# Altium schematic sheet SIM900A.SchDoc
size A4
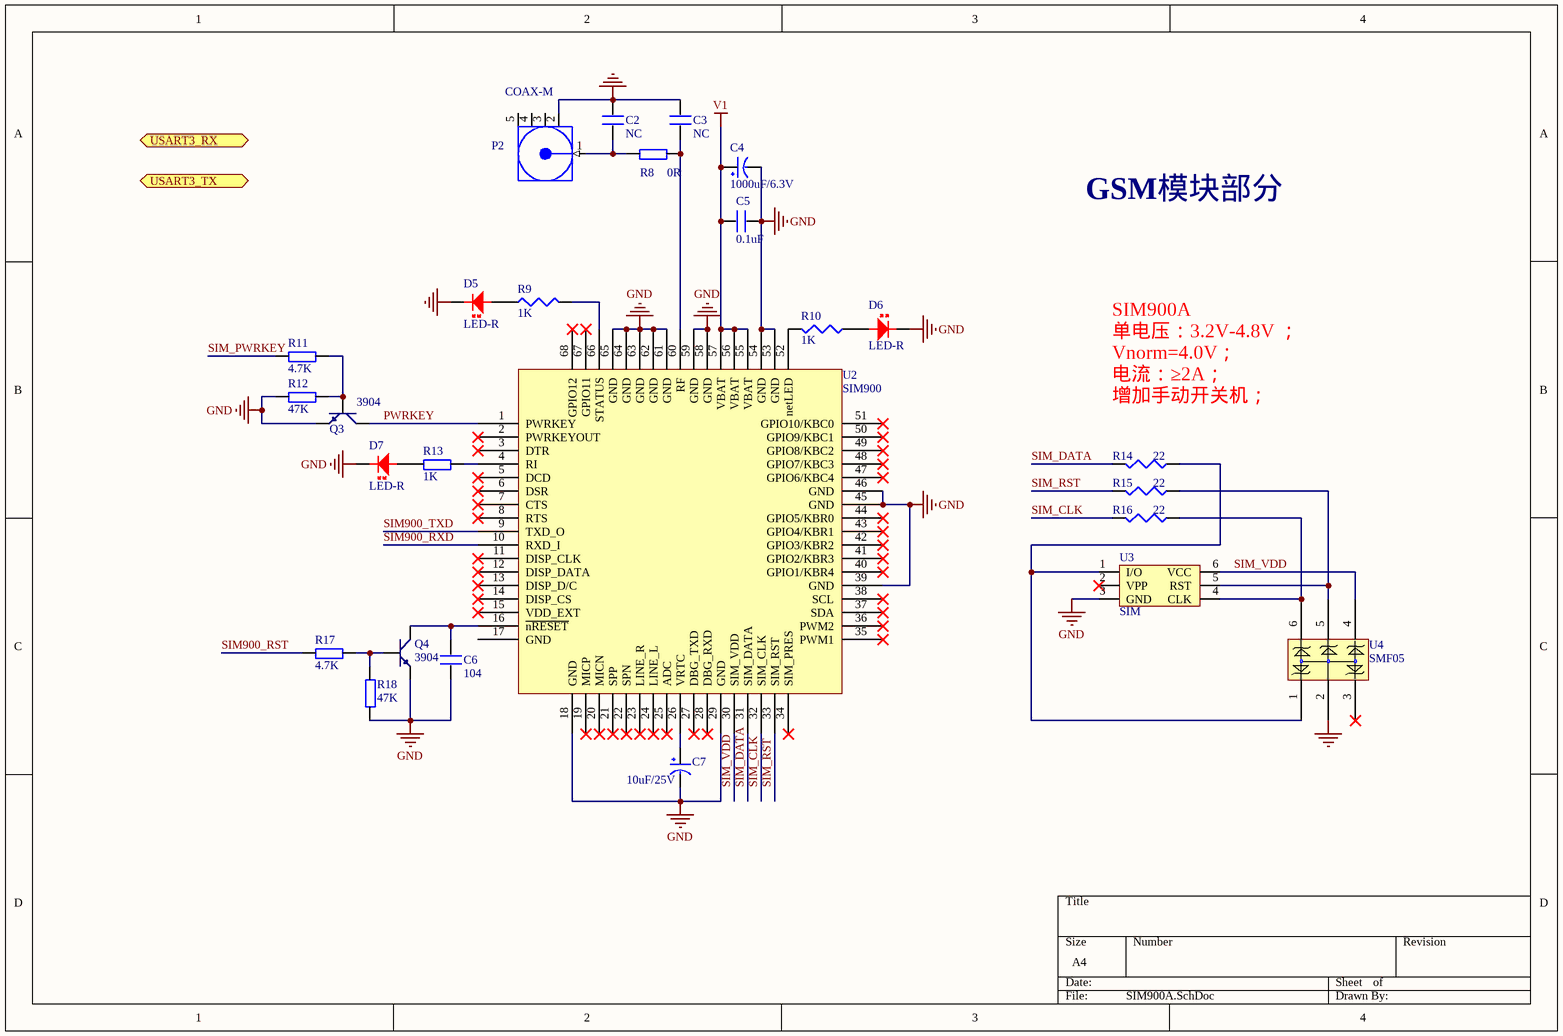
[diagram p0: SIM900A.SchDoc]

## Parts
C2  NC  [0805]
C3  NC  [0805]
C4  1000uF/6.3V  [7343]
C5  0.1uF  [0805]
C6  104  [0805]
C7  10uF/25V  [1206]
D5  LED-R  [LED-DIP]
D6  LED-R  [LED-DIP]
D7  LED-R  [LED-DIP]
P2  COAX-M  [ST-TH1]
Q3  3904  [SOT-23R]
Q4  3904  [SOT-23R]
R8  0R  [0603]
R9  1K  [0805]
R10  1K  [0805]
R11  4.7K  [0805]
R12  47K  [0805]
R13  1K  [0805]
R14  22  [0805]
R15  22  [0805]
R16  22  [0805]
R17  4.7K  [0805]
R18  47K  [0805]
U2  SIM900  [SIM-900]
U3  SIM  [sim-6p]
U4  SMF05  [SC70-6L]

## Ports
USART3_RX (out), USART3_TX (in)

## Nets
GND: C2.2 C3.2 C4.2(GND) C5.2 C6.1 C7.2(GND) D5.2 D6.2 D7.2 P2.2(GND) Q3.1(E) Q4.1(E) R12.1 R18.1 U2.18(GND) U2.29(GND) U2.39(GND) U2.45(GND) U2.46(GND) U2.53(GND) U2.54(GND) U2.58(GND) U2.59(GND) U2.61(GND) U2.62(GND) U2.63(GND) U2.64(GND) U2.65(GND) U3.3(GND) U4.2
V1: C4.1(VCC) C5.1 U2.55(VBAT) U2.56(VBAT) U2.57(VBAT)
PWRKEY: Q3.3(C) U2.1(PWRKEY)
SIM900_RST: R17.1
SIM900_RXD: U2.10(RXD_I)
SIM900_TXD: U2.9(TXD_O)
SIM_CLK: R16.2 U2.32(SIM_CLK)
SIM_DATA: R14.2 U2.31(SIM_DATA)
SIM_PWRKEY: R11.1
SIM_RST: R15.2 U2.33(SIM_RST)
SIM_VDD: U2.30(SIM_VDD) U3.6(VCC) U4.4
NetC2_1: C2.1 P2.1(Signal) R8.1
NetC3_1: C3.1 R8.2 U2.60(RF)
NetC6_2: C6.2 Q4.3(C) U2.16(~{nRESET})
NetC7_1: C7.1(VCC) U2.26(VRTC)
NetD5_1: D5.1 R9.1
NetD6_1: D6.1 R10.1
NetD7_1: D7.1 R13.1
NetQ3_2: Q3.2(B) R11.2 R12.2
NetQ4_2: Q4.2(B) R17.2 R18.2
NetR9_2: R9.2 U2.66(STATUS)
NetR10_2: R10.2 U2.52(netLED)
NetR13_2: R13.2 U2.4(RI)
NetR14_1: R14.1 U3.1(I/O) U4.1
NetR15_1: R15.1 U3.5(RST) U4.5
NetR16_1: R16.1 U3.4(CLK) U4.6

Not connected (* = marked no-connect by the designer): P2 3(GND) 4(GND) 5(GND); U2 2(PWRKEYOUT)* 3(DTR)* 5(DCD)* 6(DSR)* 7(CTS)* 8(RTS)* 11(DISP_CLK)* 12(DISP_DATA)* 13(DISP_D/C)* 14(DISP_CS)* 15(VDD_EXT)* 17(GND) 19(MICP)* 20(MICN)* 21(SPP)* 22(SPN)* 23(LINE_R)* 24(LINE_L)* 25(ADC)* 27(DBG_TXD)* 28(DBG_RXD)* 34(SIM_PRES)* 35(PWM1)* 36(PWM2)* 37(SDA)* 38(SCL)* 40(GPIO1/KBR4)* 41(GPIO2/KBR3)* 42(GPIO3/KBR2)* 43(GPIO4/KBR1)* 44(GPIO5/KBR0)* 47(GPIO6/KBC4)* 48(GPIO7/KBC3)* 49(GPIO8/KBC2)* 50(GPIO9/KBC1)* 51(GPIO10/KBC0)* 67(GPIO11)* 68(GPIO12)*; U3 2(VPP)*; U4 3*

## Notes on the sheet
- GSM模块部分
- (near R14) SIM900A
  单电压：3.2V-4.8V ；
  Vnorm=4.0V；
  电流：≥2A；
  增加手动开关机；

## Library data of the parts
C2 C3 C5 C6 = C
C4 C7 = CAP
D5-D7 = LED-RED: 红色LED
P2 = COAX-M: SMA-J-P-H-ST-TH1; PackageDocument: Rev. A, 16-Jun-1997; PCB_Layout: Complies with manufacturer's recommendation.; DrillSize: Corresponds to nominal value.; Published: 15-Jul-2004; LatestRevisionDate: 15-Jul-2004; LatestRevisionNote: Component Replaced.; DatasheetDocument: 30-May-2003; PackageReference: 908-21103; Publisher: Altium Limited; ComponentLink1Description: Manufacturer Link; ComponentLink1URL: http://www.amphenolrf.com/
Q3 Q4 = NPN: 8050/BCW846/BCW847
R8 R11-R13 R17 R18 = Res
R9 R10 R14-R16 = RES1
U3 = SIM: 手机SIM卡